# EAGLE design CAN Adapter (EAGLE 5.12)
AUTHORNAME: Aaron Bonnell-Kangas; BOARDNAME: CAN Adapter; FUNCTION: DC IN; PARTNO: RMCF1210JT680R; REVISIONDATE: v1.1.1 - 2016-02-15
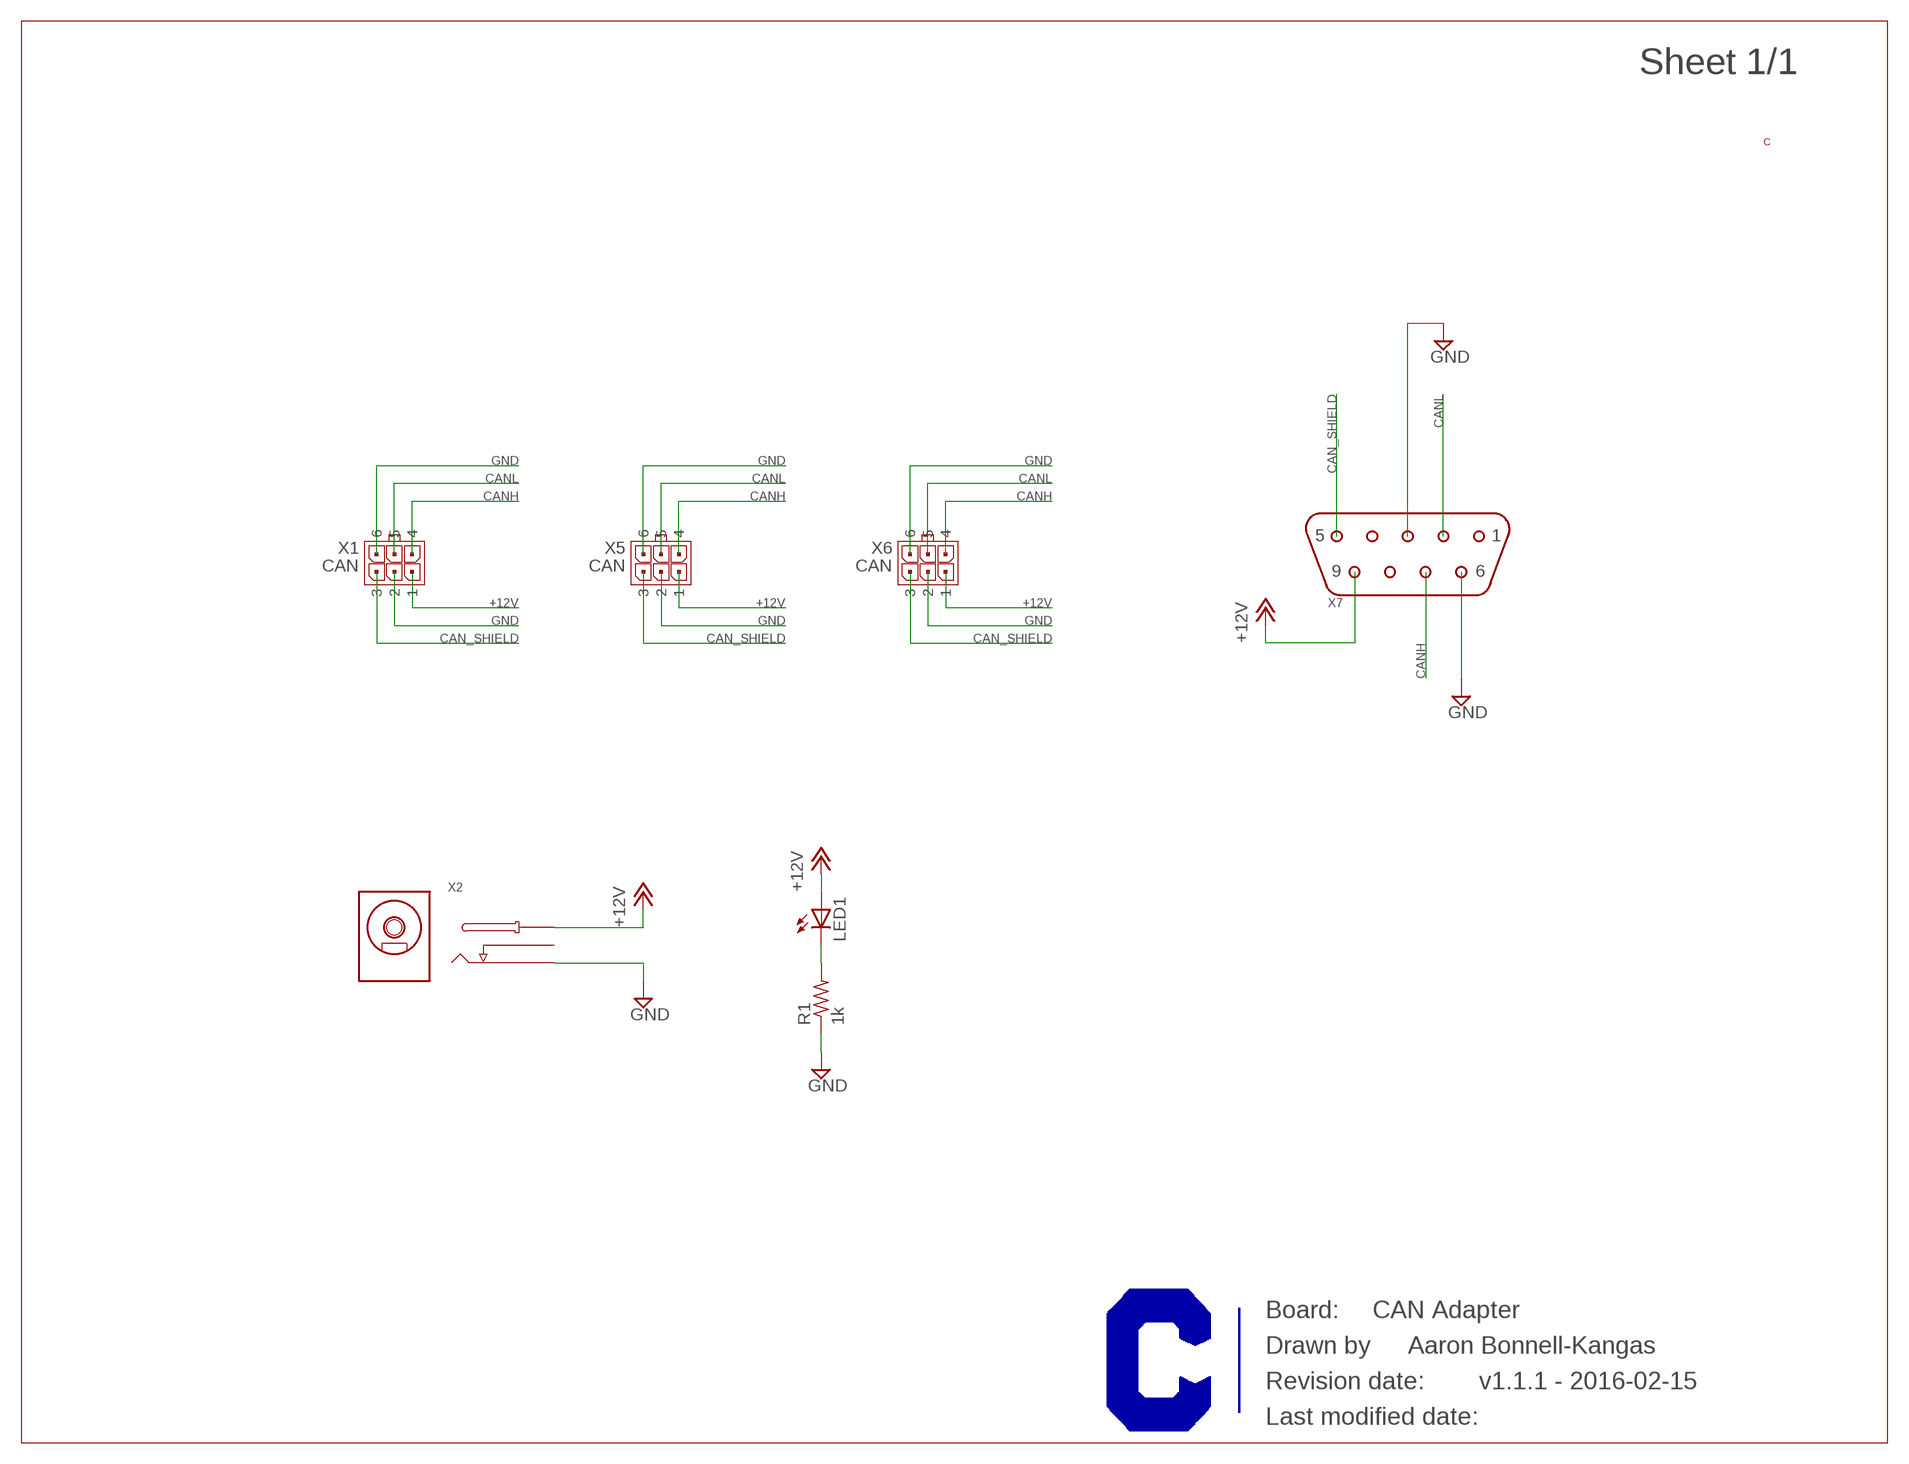
[diagram p0: schematic, sheet 1]

## Parts
LED1  LEDCHIPLED_0805  [CHIPLED_0805]
R1  1k  R-US_R1206  [R1206]
U$1  CURRENT-C-LETTER-LANDSCAPE  [BLANK]
U$2  CURRENT-LOGO-0.25"  [CURRENT-0.25"]
X1  CAN  MICROFIT-06-DUAL-THROUGH_HOLE-PEG_RETENTION-GOLD  [MICROFIT-6-DUAL-RA-THROUGH_HOLE-PEG_RETENTION]
X2  BARREL_JACK-5.5X2.1  [BARREL_JACK_5.5X2.1]
X5  CAN  MICROFIT-06-DUAL-THROUGH_HOLE-PEG_RETENTION-GOLD  [MICROFIT-6-DUAL-RA-THROUGH_HOLE-PEG_RETENTION]
X6  CAN  MICROFIT-06-DUAL-THROUGH_HOLE-PEG_RETENTION-GOLD  [MICROFIT-6-DUAL-RA-THROUGH_HOLE-PEG_RETENTION]
X7  DE-9_DB-9-RCPT-RA  [DE-9_RA]

## Nets
+12V: LED1.A X1.1 X2.1(TIP) X5.1 X6.1 X7.9
CAN_SHIELD: X1.3 X5.3 X6.3 X7.5
CANH: X1.4 X5.4 X6.4 X7.7
CANL: X1.5 X5.5 X6.5 X7.2
GND: R1.1 X1.2 X1.6 X2.2(SLEEVE) X5.2 X5.6 X6.2 X6.6 X7.3 X7.6
N$1: LED1.C R1.2
Unconnected: X2.3(BREAK) X7.1 X7.4 X7.8

## Library data of the parts
LED1 = led:LED: LED OSRAM: - CHIPLED LG R971, LG N971, LY N971, LG Q971, LY Q971, LO R971, LY R971 LH N974, LH R974 LS Q976, LO Q976, LY Q976 LO Q996 - Hyper CHIPLED LW Q18S LB Q993, LB Q99A, LB R99A - SideLED LS A670, LO A670, LY A670, LG A670, LP A670 LB A673, LV A673, LT A673, LW A673 LH A674 LY A675 LS A676, LA A676, LO A676, LY A676, LW A676 LS A679, LY A679, LG A679 - Hyper Micro SIDELED® LS Y876, LA Y876, LO Y876, LY Y876 LT Y87S - SmartLED LW L88C, LW L88S LB L89C, LB L89S, LG L890 LS L89K, LO L89K, LY L89K LS L896, LA L896, LO L896, LY L896 - TOPLED LS T670, LO T670, LY T670, LG T670, LP T670 LSG T670, LSP T670, LSY T670, LOP T670, LYG T670 LG T671, LOG T671, LSG T671 LB T673, LV T673, LT T673, LW T673 LH T674 LS T676, LA T676, LO T676, LY T676, LB T676, LH T676, LSB T676, LW T676 LB T67C, LV T67C, LT T67C, LS T67K, LO T67K, LY T67K, LW E67C LS E67B, LA E67B, LO E67B, LY E67B, LB E67C, LV E67C, LT E67C LW T67C LS T679, LY T679, LG T679 LS T770, LO T770, LY T770, LG T770, LP T770 LB T773, LV T773, LT T773, LW T773 LH T774 LS E675, LA E675, LY E675, LS T675 LS T776, LA T776, LO T776, LY T776, LB T776 LHGB T686 LT T68C, LB T68C - Hyper Mini TOPLED® LB M676 - Mini TOPLED Santana® LG M470 LS M47K, LO M47K, LY M47K Source: http://www.osram.convergy.de LUXEON: - LUMILED® LXK2-PW12-R00, LXK2-PW12-S00, LXK2-PW14-U00, LXK2-PW14-V00 LXK2-PM12-R00, LXK2-PM12-S00, LXK2-PM14-U00 LXK2-PE12-Q00, LXK2-PE12-R00, LXK2-PE12-S00, LXK2-PE14-T00, LXK2-PE14-U00 LXK2-PB12-K00, LXK2-PB12-L00, LXK2-PB12-M00, LXK2-PB14-N00, LXK2-PB14-P00, LXK2-PB14-Q00 LXK2-PR12-L00, LXK2-PR12-M00, LXK2-PR14-Q00, LXK2-PR14-R00 LXK2-PD12-Q00, LXK2-PD12-R00, LXK2-PD12-S00 LXK2-PH12-R00, LXK2-PH12-S00 LXK2-PL12-P00, LXK2-PL12-Q00, LXK2-PL12-R00 Source: www.luxeon.com KINGBRIGHT: KA-3528ASYC Source: www.kingbright.com
R1 = rcl:R-US_: RESISTOR, American symbol
U$1 = Frames:CURRENT-C-LETTER-LANDSCAPE; BOM: EXCLUDE
U$2 = Logos:CURRENT-LOGO; BOM: EXCLUDE
X1 X5 X6 = Molex:MICROFIT-06-DUAL: Molex MicroFit 3.00mm Pitch Header, Surface Mount, Dual Row, 6 Circuits Note, November 2014: These come in three styles: Through-hole, with metal clip retention to PCB (not currently represented) (cheapest) SMD, with solder tab retention (-SMD) (more expensive, commonly stocked) SMD, with metal clip retention (-SMD-CLIP_RETENTION) (most expensive, not often stocked) Please use them in that order! Drawing: http://www.molex.com/pdm_docs/sd/430450609_sd.pdf (right-angle) Information: http://www.molex.com/molex/products/datasheet.jsp?part=active/0430450618_PCB_HEADERS.xml; PARTNO: 43045-0601
X2 = Generic connectors:BARREL_JACK: DC power jack, cylindrical, barrel style This is a common type of input power connector.; PARTNO: PJ-002A
X7 = Generic footprints:DE-9_DB-9: DE-9 (aka DB-9) PCB header The actual descriptor for this connector is DE-9 (shell size DE, 9 positions), but it is commonly referred to as DB-9.; PARTNO: 1734354-1

## Board
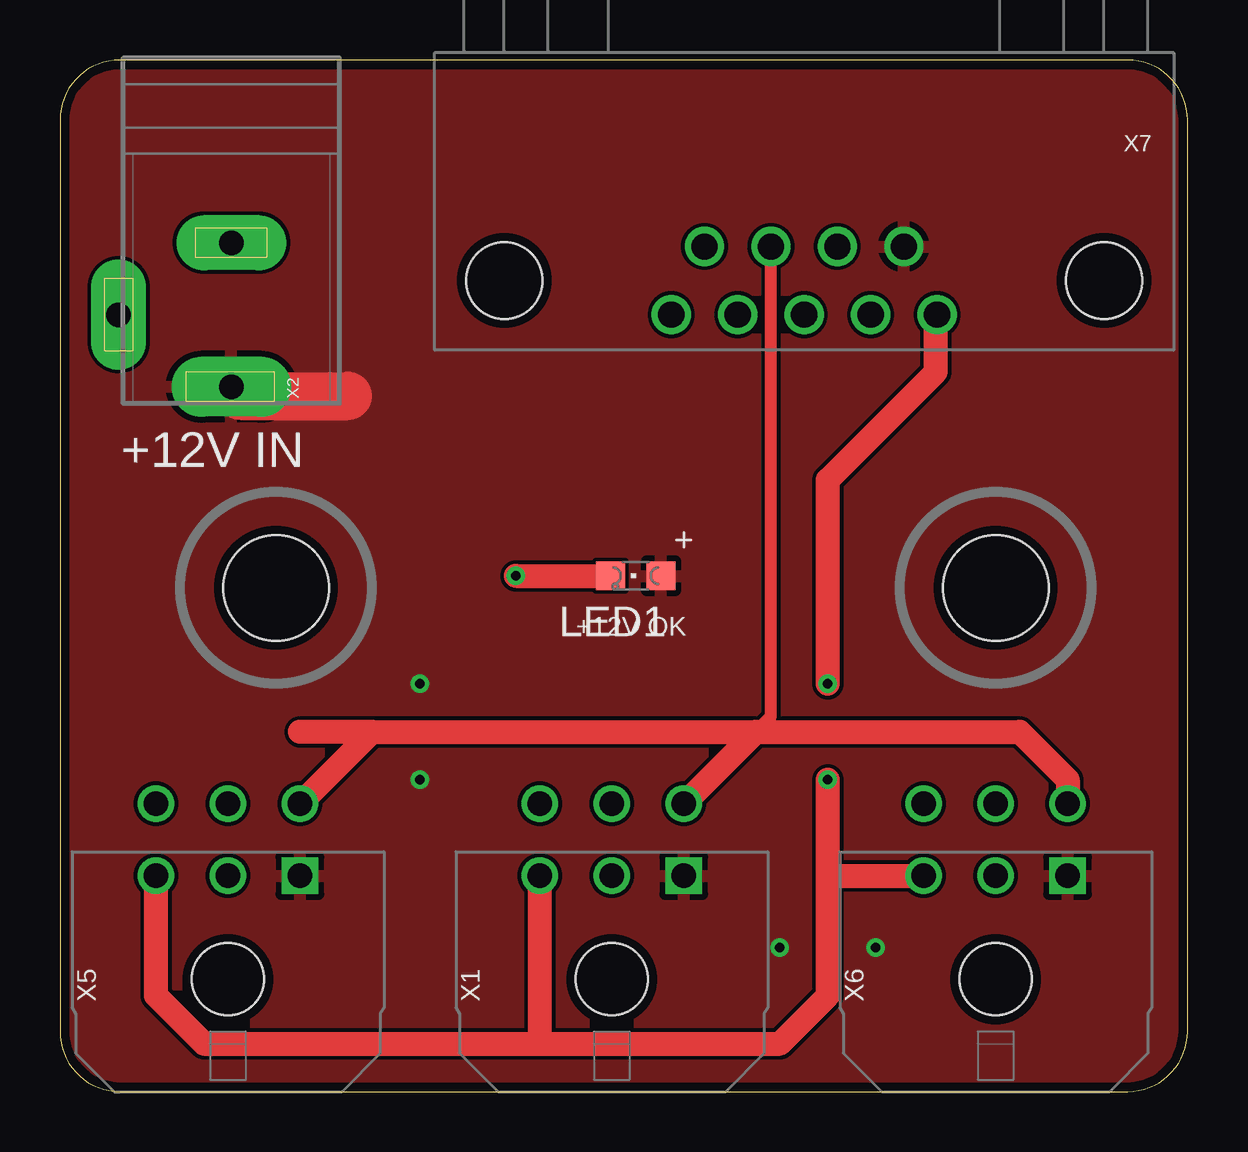
[diagram p1: board, top side]
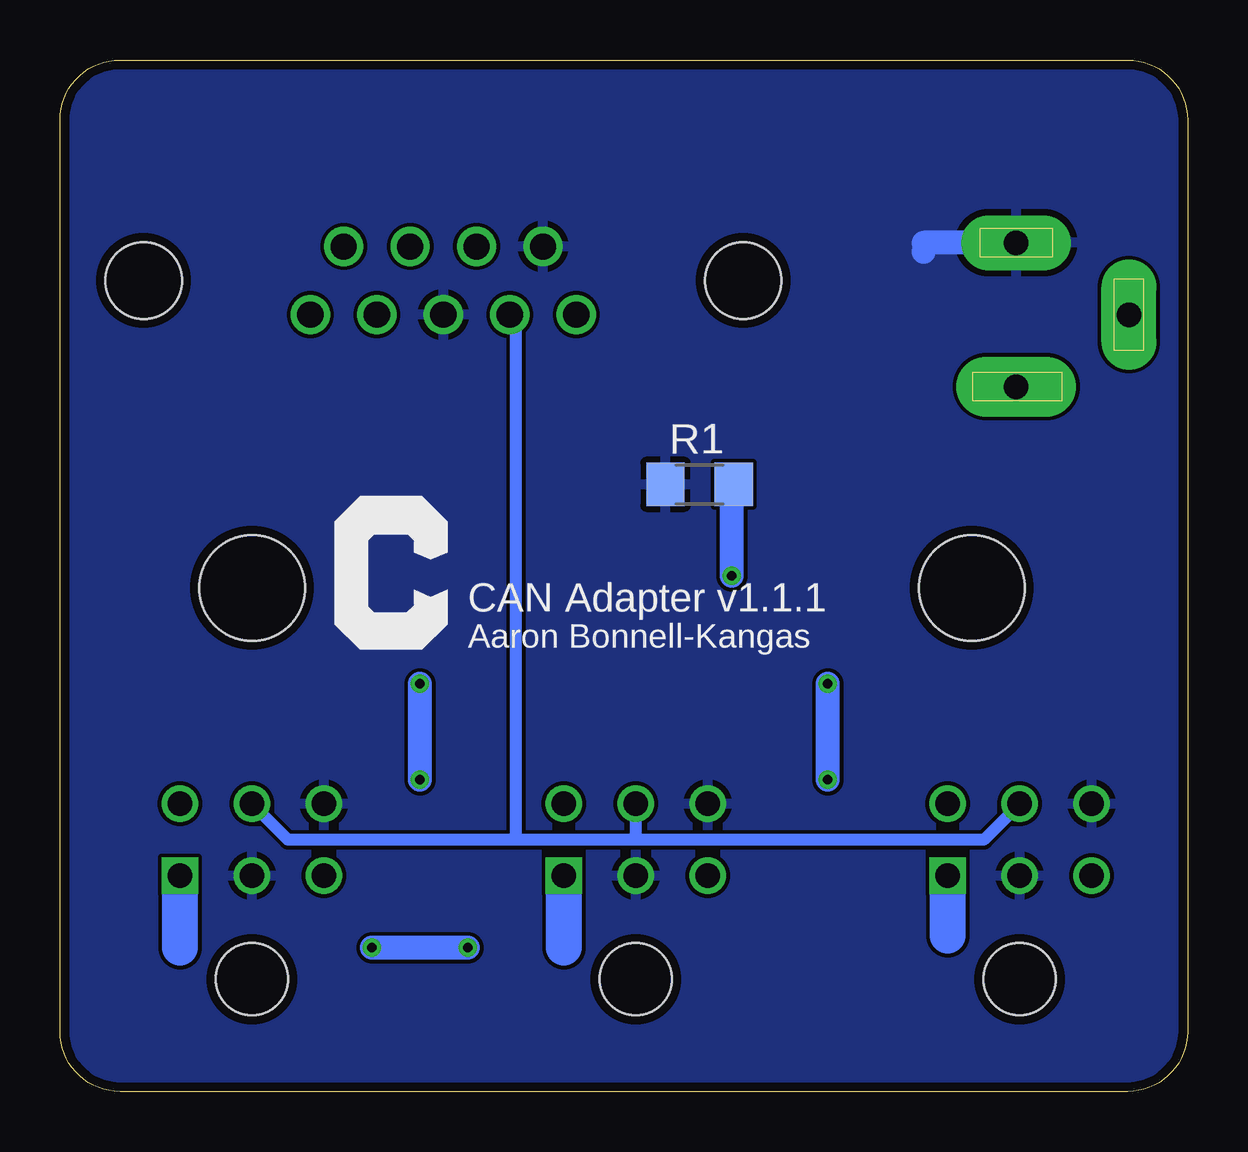
[diagram p2: board, bottom side, seen from below]

Size 47 x 43 mm. Coordinates in mm from the lower left corner, seen from the top.
Outline: 2.5,43 arc90 0,40.5 0,2.5 arc90 2.5,0 44.5,0 arc90 47,2.5 47,40.5 arc90 44.5,43 2.5,43
Copper layers (1*16): Top 0.0356mm / dielectric 1.5011mm / Bottom 0.0356mm
Design rules "OSH Park 2-layer": minimum track width 6mil, minimum drill 13mil, track to track 6mil, track to pad 6mil, pad to pad 6mil, via to via 6mil, smd to smd 6mil, copper to edge 15mil, drill to drill 6mil, minimum pad ring 7mil, minimum via ring 7mil, stop-mask expansion 4mil, vias tented up to drill 25mil, thermal gap 10mil
Holes 4.4 mm at 39,21 9,21

### Footprints (pad centres in the part's own frame; a part is rotated, then mirrored left to right if it is on the bottom)
CHIPLED_0805 = smd 1.2 x 1.2: A 0,-1.05; C 0,1.05
R1206 = smd 1.6 x 1.803: 1 -1.422,0; 2 1.422,0
MICROFIT-6-DUAL-RA-THROUGH_HOLE-PEG_RETENTION = drill 1.02 square: 1 3,0 | drill 1.02 round: 2 0,0; 3 -3,0; 4 3,3; 5 0,3; 6 -3,3 | hole 3: 0,-4.32
BARREL_JACK_5.5X2.1 = drill 1.02 pad 2.5 long: 1 -3,-4.7 | drill 1.02 pad 2.3 long: 2 3,-4.7; 3 0,0
DE-9_RA = drill 1.09 round: 1 5.54,0; 2 2.77,0; 3 0,0; 4 -2.77,0; 5 -5.54,0; 6 4.155,-2.84; 7 1.385,-2.84; 8 -1.385,-2.84; 9 -4.155,-2.84 | hole 3.18: -12.495,-1.42; 12.495,-1.42

### Placement (x,y rotation side)
LED1  24,21.5 90 top
R1  20.34,25.31 0 bottom
U$1  -57.15,67.31 0 top  (outside the outline)
U$2  35.5,18.5 0 bottom
X1  23,9 0 top
X2  2.44,32.38 90 top
X5  7,9 0 top
X6  39,9 0 top
X7  31.02,32.38 180 top

### Tracks (layer width: path | path; a pad name or v marks a point on that pad's centre or on a via)
+12V  (via drill 0.4)
  Top 2: X2.1 7.53,29 12,29
  Bottom 1: v30,6 v34,6 | v15,13 v15,17
  Bottom 1.5: 10,6.5 X5.1 | 26,6 X1.1 | 42,6 X6.1
  pour Top: 0,0 47,0 47,42.5 0,42.5
CAN_SHIELD  (via drill 0.4)
  Top 1: X7.5 36.5,32.33 36.5,30 32,25.5 v32,17 | 32,9 32,4 30,2 20,2 | 32,9 v32,13 | 20,2 6,2 4,4 X5.3 | 20,2 X1.3 | 32,9 X6.3
  Bottom 1: v32,13 v32,17
CANH
  Top 0.5: X7.7 29.64,15.63 29,15
  Top 1: 13,15 10,15 | 13,15 29,15 | 29,15 40,15 42,13 X6.4 | X5.4 13,15 | 29,15 X1.4
CANL
  Bottom 0.5: X7.2 28,32.13 28,10.5 | X5.5 8.5,10.5 23,10.5 | 23,10.5 28,10.5 | 28,10.5 37.5,10.5 X6.5 | 23,10.5 X1.5
GND
  Bottom 1: X2.2 11,35.38 11,35
  pour Bottom (rank 2): 0,0 47,0 47,43 0,43
N$1  (via drill 0.4)
  Top 1: v19,21.5 LED1.C
  Bottom 1: v19,21.5 19,25.23 R1.2

### Text on the board
tPlace: +12V IN | +12V OK
bPlace: CAN Adapter v1.1.1 | Aaron Bonnell-Kangas